# Altium project oblig4BGJ.PrjPcb
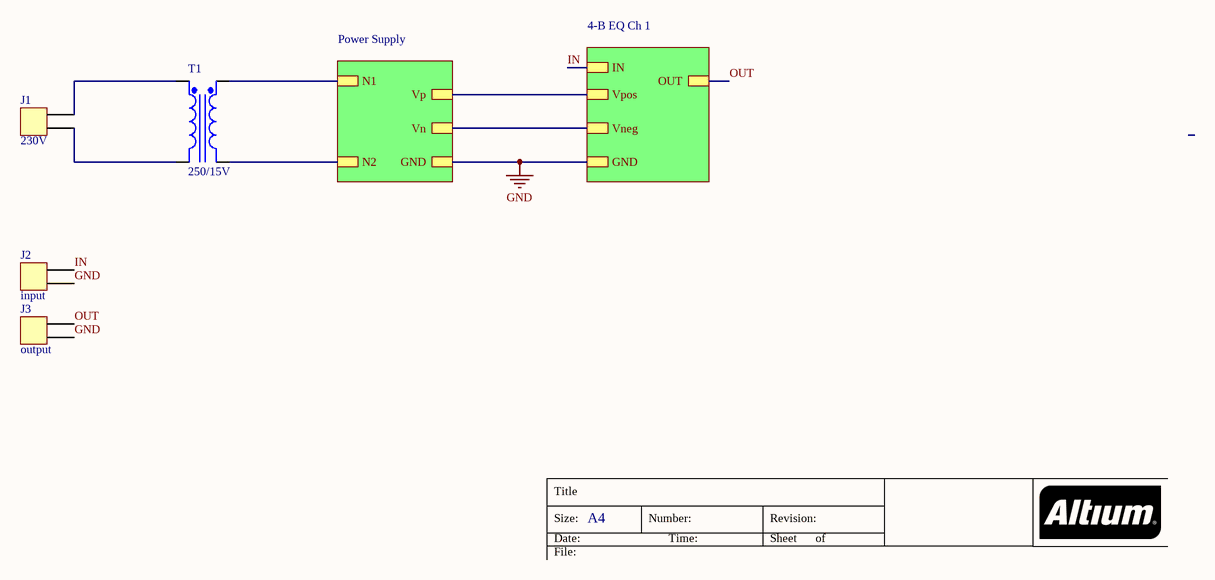
[diagram p0: 4bandequi.SchDoc]
3 sheets, 32 parts. Net scope: hierarchical (ports join the sheet entries above them; power ports are global).
Board file: utlegg.PcbDoc
Sheets:
  4bandequi.SchDoc
    Power Supply = Power supply.SchDoc
    4-B EQ Ch 1 = channel 1.SchDoc

## Sheet 4bandequi.SchDoc: 4-Band Equilizer
size A4; Organization: UiT; Address1: Bjørn Jonas; Address2: Lodve Langes gt. 2; Address3: 8514 Narvik; Address4: Norge; DocumentNumber: 1; Revision: a; SheetNumber: 1; SheetTotal: 3; SPICEModelCacheATUXSGBO: <root> / <DocumentId>ATUXSGBO</DocumentId> / <CacheFrame Number="0"> / <Model Name="trans" Kind="CKT"> / <Text>*Generic Transformer / *dw: 2-8-99 corrected VISRC polarity and FCTRL configuration / *Connections: / *             Pri+ / *             | Pri- / *             | | Sec+ / *             | | | Sec- / *             | | | | / .SUBCKT TRANS 1 2 3 4 PARAMS: RATIO=1 RP=0.1 RS=0.1 LEAK=1u MAG=1k / VISRC   4 9 0V / FCTRL   5 2 VISRC {RATIO} / EVCVS   8 9 5 2 {RATIO} / RPRI    1 7 {RP} / RSEC    8 3 {RS} / LLEAK   7 5 {LEAK} / LMAGNET 2 5 {MAG} / .ENDS TRANS</Text> / </Model> / </CacheFrame> / </root>

### Parts
J1  230V  [Header 2]
J2  input  [150mil header]
J3  output  [150mil header]
T1  250/15V  [trans]

### Sub-sheets
4-B EQ Ch 1 = channel 1: IN, Vpos, Vneg, GND, OUT
Power Supply = Power supply: N1, N2, Vp, GND, Vn

### Nets
GND: J2.2 J3.2 T1.4(Sec-) ; sheet Power Supply/N2, sheet Power Supply/GND, sheet 4-B EQ Ch 1/GND
IN: J2.1 ; sheet 4-B EQ Ch 1/IN
OUT: J3.1 ; sheet 4-B EQ Ch 1/OUT
Vneg: sheet Power Supply/Vn, sheet 4-B EQ Ch 1/Vneg
Vpos: sheet Power Supply/Vp, sheet 4-B EQ Ch 1/Vpos
NetD1_1: T1.3(Sec+) ; sheet Power Supply/N1
NetJ1_1: J1.1 T1.1(Pri+)
NetJ1_2: J1.2 T1.2(Pri-)

### Notes on the sheet
- Title
- Size:
- Date:
- A4
- Number:
- Time:
- Revision:
- Sheet
- of
- File:

### Library data of the parts
J1-J3 = Header_2
T1 = Trans Eq: Transformer (Equivalent Circuit Model); Published: 8-Jun-2000; LatestRevisionDate: 17-Jul-2002; LatestRevisionNote: Re-released for DXP Platform.; PackageReference: TRF_4; Publisher: Altium Limited; PackageDescription: Transformer; 4 Leads

## Sheet Power supply.SchDoc
size A4; SheetNumber: 2; SheetTotal: 3; SPICEModelCacheWOPLTYCT: <root> / <DocumentId>WOPLTYCT</DocumentId> / <CacheFrame Number="0"> / <Model Name="1n4001" Kind="MDL"> / <Text>*1N4001 MCE 8-16-95 / *50V 1A Si GenPurpose Diode pkg:DIODE0.4 1,2 / .MODEL 1N4001 D(IS=2.55E-9 RS=0.042 N=1.75 TT=5.76E-6 CJO=1.85E-11 / + VJ=0.75 M=0.333 BV=50 IBV=1E-5 )</Text> / </Model> / </CacheFrame> / </root>
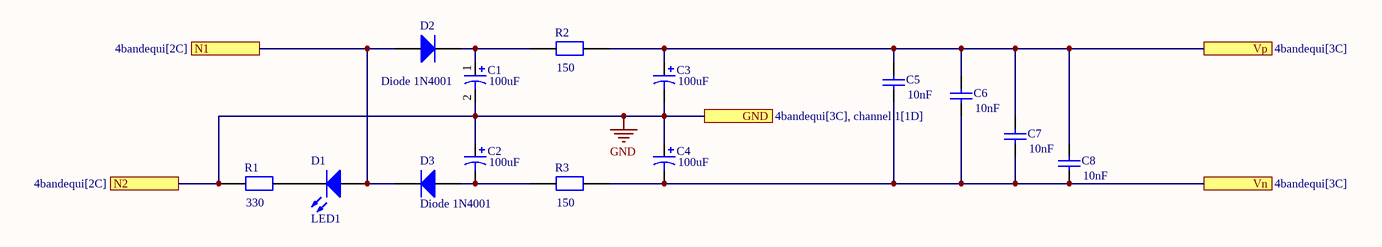
[diagram p1: Power supply.SchDoc]

### Parts
C1  value 100uF  [pol. cap.]  (hidden comment: Cap Pol1)
C2  value 100uF  [pol. cap.]  (hidden comment: Cap Pol1)
C3  value 100uF  [pol. cap.]  (hidden comment: Cap Pol1)
C4  value 100uF  [pol. cap.]  (hidden comment: Cap Pol1)
C5  value 10nF  [Capacitor]  (hidden comment: Cap)
C6  value 10nF  [Capacitor]  (hidden comment: Cap)
C7  value 10nF  [Capacitor]  (hidden comment: Cap)
C8  value 10nF  [Capacitor]  (hidden comment: Cap)
D1  LED1  [LED]
D2  Diode 1N4001  [DO-41]
D3  Diode 1N4001  [DO-41]
R1  value 330  [resistor]  (hidden comment: Resistor_Axial)
R2  value 150  [resistor]  (hidden comment: Resistor_Axial)
R3  value 150  [resistor]  (hidden comment: Resistor_Axial)

### Ports
GND (see 4bandequi[3C], channel 1[1D]), N1 (see 4bandequi[2C]), N2 (see 4bandequi[2C]), Vn (see 4bandequi[3C]), Vp (see 4bandequi[3C])

### Nets
GND: C1.2 C2.1 C3.2 C4.1 R1.1 ; port N2, port GND
Vneg: C4.2 C5.2 C6.2 C7.2 C8.2 R3.2 ; port Vn
Vpos: C3.1 C5.1 C6.1 C7.1 C8.1 R2.2 ; port Vp
NetC1_1: C1.1 D2.2(K) R2.1
NetC2_2: C2.2 D3.1(A) R3.1
NetD1_1: D1.1(A) D2.1(A) D3.2(K) ; port N1
NetD1_2: D1.2(K) R1.2

### Library data of the parts
C1-C4 = Cap Pol1: Polarized Capacitor (Radial); Published: 8-Jun-2000; LatestRevisionDate: 17-Jul-2002; LatestRevisionNote: Re-released for DXP Platform.; PackageReference: RB7.6-15; Publisher: Altium Limited; PackageDescription: Polarized Capacitor (Radial); 2 Leads
C5-C8 = Cap: Capacitor; Published: 8-Jun-2000; LatestRevisionDate: 17-Jul-2002; LatestRevisionNote: Re-released for DXP Platform.; PackageReference: RAD-0.3; Publisher: Altium Limited; PackageDescription: Radial Cap, Thru-Hole; 2 Leads; 0.3 in Pin Spacing
D1 = LED1: Typical RED GaAs LED; Published: 8-Jun-2000; LatestRevisionDate: 08-Jul-2005; LatestRevisionNote: Mech Layer 1 removed.; PackageReference: LED-1; Publisher: Altium Limited; PackageDescription: LED; 2 Leads
D2 D3 = Diode 1N4001: 1 Amp General Purpose Rectifier; Published: 8-Jun-2000; LatestRevisionDate: 17-Jul-2002; LatestRevisionNote: Re-released for DXP Platform.; DatasheetVersion: 1998; PackageVersion: Aug-1999; PackageReference: DO-41; Publisher: Altium Limited; PackageDescription: Diode, Axial; Body 5.2 x 2.7 mm (LxDia. max), Lead Dia. 0.86 mm (max); Code_JEDEC: DO-204-AL; ComponentLink1Description: Manufacturer Link; ComponentLink1URL: http://www.fairchildsemi.com/; ComponentLink2Description: Datasheet; ComponentLink2URL: http://www.fairchildsemi.com/ds/1N%2F1N4001.pdf
R1-R3 = Resistor_Axial: resistor; Resistance: *

## Sheet channel 1.SchDoc
size A4; SheetNumber: 3; SheetTotal: 3; SPICEModelCacheWKREIJUR: <root> / <DocumentId>WKREIJUR</DocumentId> / <CacheFrame Number="0"> / <Model Name="pot" Kind="CKT"> / <Text>*------------------------------------------------------------------------------------------------------------------------- / * potentiometer position must be between 0 and 1 / .SUBCKT POT in out pos params: value=1k  position=0.5 / r1 in pos {value*position} / r2 pos out {value*(1.0-position)} / .ENDS</Text> / </Model> / <Model Name="ne5532" Kind="CKT"> / <Text>* NE5532 OPERATIONAL AMPLIFIER "MACROMODEL" SUBCIRCUIT / * CREATED USING NE5534 model from Texas InstrumentsAT 12:41 / * (REV N/A)      SUPPLY VOLTAGE: +/-15V / * CONNECTIONS:   NON-INVERTING INPUT / *                | INVERTING INPUT / *                | | POSITIVE POWER SUPPLY / *                | | | NEGATIVE POWER SUPPLY / *                | | | | OUTPUT / *                | | | | | / .SUBCKT NE5532   1 2 3 4 5 / * / C1   11 12 7.703E-12 / C2    6  7 23.500E-12 / DC    5 53 DX / DE   54  5 DX / DLP  90 91 DX / DLN  92 90 DX / DP    4  3 DX / EGND 99  0 POLY(2) (3,0) (4,0) 0 .5 .5 / FB    7 99 POLY(5) VB VC VE VLP VLN 0 2.893E6 -3E6 3E6 3E6 -3E6 / GA    6  0 11 12 1.382E-3 / GCM   0  6 10 99 13.82E-9 / IEE  10  4 DC 133.0E-6 / HLIM 90  0 VLIM 1K / Q1   11  2 13 QX / Q2   12  1 14 QX / R2    6  9 100.0E3 / RC1   3 11 723.3 / RC2   3 12 723.3 / RE1  13 10 329 / RE2  14 10 329 / REE  10 99 1.504E6 / RO1   8  5 50 / RO2   7 99 25 / RP    3  4 7.757E3 / VB    9  0 DC 0 / VC    3 53 DC 2.700 / VE   54  4 DC 2.700 / VLIM  7  8 DC 0 / VLP  91  0 DC 38 / VLN   0 92 DC 38 / .MODEL DX D(IS=800.0E-18) / .MODEL QX NPN(IS=800.0E-18 BF=132) / .ENDS</Text> / </Model> / </CacheFrame> / </root>
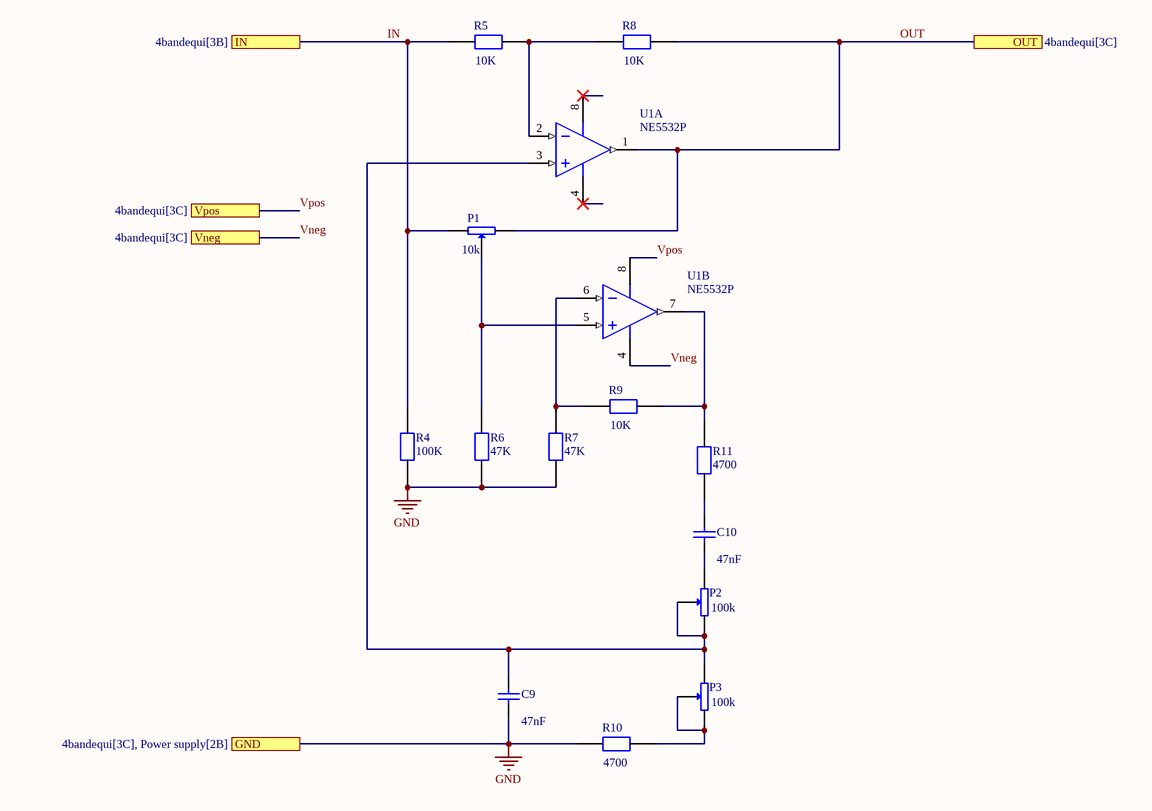
[diagram p2: channel 1.SchDoc]

### Parts
C9  value 47nF  [Capacitor]  (hidden comment: Cap)
C10  value 47nF  [Capacitor]  (hidden comment: Cap)
P1  value 10k  [header 3]  (hidden comment: potentiometer)
P2  value 100k  [header 3]  (hidden comment: potentiometer)
P3  value 100k  [header 3]  (hidden comment: potentiometer)
R4  value 100K  [resistor]  (hidden comment: Resistor_Axial)
R5  value 10K  [resistor]  (hidden comment: Resistor_Axial)
R6  value 47K  [resistor]  (hidden comment: Resistor_Axial)
R7  value 47K  [resistor]  (hidden comment: Resistor_Axial)
R8  value 10K  [resistor]  (hidden comment: Resistor_Axial)
R9  value 10K  [resistor]  (hidden comment: Resistor_Axial)
R10  value 4700  [resistor]  (hidden comment: Resistor_Axial)
R11  value 4700  [resistor]  (hidden comment: Resistor_Axial)
U1  NE5532P  [opamp]  (parts A,B of 2)

### Ports
GND (see 4bandequi[3C], Power supply[2B]), IN (see 4bandequi[3B]), OUT (see 4bandequi[3C]), Vneg (see 4bandequi[3C]), Vpos (see 4bandequi[3C])

### Nets
GND: C9.1 R4.1 R6.2 R7.1 R10.1 ; port GND
IN: P1.3 R4.2 R5.1 ; port IN
OUT: P1.1 R8.2 U1.1(OUT1) ; port OUT
Vneg: U1.4(VCC-) ; port Vneg
Vpos: U1.8(VCC+) ; port Vpos
NetC9_2: C9.2 P2.1 P2.2 P3.3 U1.3(IN1+)
NetC10_1: C10.1 P2.3
NetC10_2: C10.2 R11.1
NetP1_2: P1.2 R6.1 U1.5(IN2+)
NetP3_1: P3.1 P3.2 R10.2
NetR5_2: R5.2 R8.1 U1.2(IN1-)
NetR7_2: R7.2 R9.1 U1.6(IN2-)
NetR9_2: R9.2 R11.2 U1.7(OUT2)

### Library data of the parts
C9 C10 = Cap: Capacitor; Published: 8-Jun-2000; LatestRevisionDate: 17-Jul-2002; LatestRevisionNote: Re-released for DXP Platform.; PackageReference: RAD-0.3; Publisher: Altium Limited; PackageDescription: Radial Cap, Thru-Hole; 2 Leads; 0.3 in Pin Spacing
P1 = potentiometer: position: 0.5
P2 P3 = potentiometer: position: 0.99
R4-R11 = Resistor_Axial: resistor; Resistance: *
U1 = CMP-0017-00910-2: Dual Low-Noise High-Speed Audio Operational Amplifier, 10 to 30 V, 0 to 70 degC, 8-pin DIP (P8), Pb-Free (RoHS); Manufacturer: Texas Instruments; Iq per channel(Max)(mA): 4; Slew Rate(Typ)(V/us): 9; Vn at 1kHz(Typ)(nV/rtHz): 5; IIB(Max)(pA): 800000; Total Supply Voltage(Max)(+5V is 5, +/-5V is 10): 30; GBW(Typ)(MHz): 10; CMRR(Min)(dB): 70; Number of Channels: 2; Sub Family: General Purpose Amplifier, High Supply Voltage Amplifier (>=30V), Low Noise Amp (<=10nV/rtHz); ComponentLink2URL: http://www.ti.com/lit/ds/symlink/ne5532.pdf; PackageReference: P0008A; PackageDescription: 8-Pin Plastic In-Line, Body 9.59 x 6.35 mm, Pitch 2.54 mm; ComponentLink1Description: Manufacturer URL; Eco-Plan: Pb-Free (RoHS); Mounting Technology: Through Hole; Code_JEDEC: MS-001; PackageVersion: 4040082/E, 04/2010; DatasheetVersion: SLOS075I; ComponentLink3URL: http://www.ti.com/litv/pdf/mpdi001b; ComponentLink2Description: Datasheet; Vio (25C)(Max)(mV): 4; PartNumber: NE5532P; ComponentLink3Description: Package Specification; Total Supply Voltage(Min)(+5V is 5, +/-5V is 10): 10; ComponentLink1URL: http://www.ti.com/

## Nets that join several sheets
GND: 4bandequi (J2.2 J3.2 T1.4), Power supply (5 pins), channel 1 (5 pins)
IN: 4bandequi (J2.1), channel 1 (P1.3 R4.2 R5.1)
NetD1_1: 4bandequi (T1.3), Power supply (D1.1 D2.1 D3.2)
OUT: 4bandequi (J3.1), channel 1 (P1.1 R8.2 U1.1)
Vneg: Power supply (6 pins), channel 1 (U1.4)
Vpos: Power supply (6 pins), channel 1 (U1.8)